# EAGLE design DHT22 Humidity-Temp (EAGLE 8.6.0)
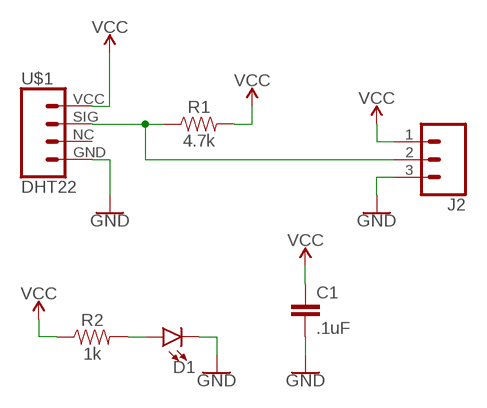
[diagram p0: schematic, sheet 1]

## Parts
C1  .1uF  1.0UF-0805-25V-(+80/-20%)  [0805]
D1  LED-3MM-NO_SILK  [LED_3MM-NS]
J2  CONN_03LONGPADS  [1X03_LONGPADS]
R1  4.7k  0.3OHM-0805-1/8W-1%  [0805]
R2  1k  0.3OHM-0805-1/8W-1%  [0805]
U$1  DHT22  [DHT22]

## Nets
GND: C1.2 D1.K(C) J2.3 U$1.GND
N$4: D1.A R2.2
SIGNAL: J2.2 R1.1 U$1.SIG
VCC: C1.1 J2.1 R1.2 R2.1 U$1.VCC
Unconnected: U$1.NC

## Library data of the parts
C1 = SparkFun-Capacitors:1.0UF: 1µF ceramic capacitors A capacitor is a passive two-terminal electrical component used to store electrical energy temporarily in an electric field.; PROD_ID: CAP-11625; VALUE: 1.0uF
D1 = SparkFun-LED:LED: LED (Generic) Standard schematic elements and footprints for 5mm, 3mm, 1206, and 0603 sized LEDs. Generic LEDs with no color specified.
J2 = SparkFun-Connectors:CONN_03: Multi connection point. Often used as Generic Header-pin footprint for 0.1 inch spaced/style header connections On any of the 0.1 inch spaced packages, you can populate with these: Break Away Headers - Straight <https://www.sparkfun.com/products/116> (PRT-00116) Break Away Male Headers - Right Angle <https://www.sparkfun.com/products/553> (PRT-00553) Female Headers <https://www.sparkfun.com/products/115> (PRT-00115) Break Away Headers - Machine Pin <https://www.sparkfun.com/products/117> (PRT-00117) Break Away Female Headers - Swiss Machine Pin <https://www.sparkfun.com/products/743> (PRT-00743) Stackable Header - 3 Pin (Female, 0.1") <https://www.sparkfun.com/products/13875> (PRT-13875) For SCREWTERMINALS and SPRING TERMINALS visit here: Screw Terimnals on SparkFun.com <https://www.sparkfun.com/search/results?term=Screw+Terminals> (5mm/3.5mm/2.54mm spacing) This device is also useful as a general connection point to wire up your design to another part of your project. Our various solder wires solder well into these plated through hole pads. Hook-Up Wire - Assortment (Stranded, 22 AWG) <https://www.sparkfun.com/products/11375> (PRT-11375) Hook-Up Wire - Assortment (Solid Core, 22 AWG) <https://www.sparkfun.com/products/11367> (PRT-11367) View the entire wire category on our website here <https://www.sparkfun.com/categories/141> Special notes: Molex polarized connector foot print use with SKU : PRT-08232 with associated crimp pins and housings.
R1 R2 = SparkFun-Resistors:0.3OHM: 0.3Ω resistor A resistor is a passive two-terminal electrical component that implements electrical resistance as a circuit element. Resistors act to reduce current flow, and, at the same time, act to lower voltage levels within circuits. - Wikipedia; PROD_ID: RES-11622; VALUE: 0.3
U$1 = SparkFun-Connectors:DHT22: DHT22 Humidity/Temperature Sensor - Generic Footprint

## Board
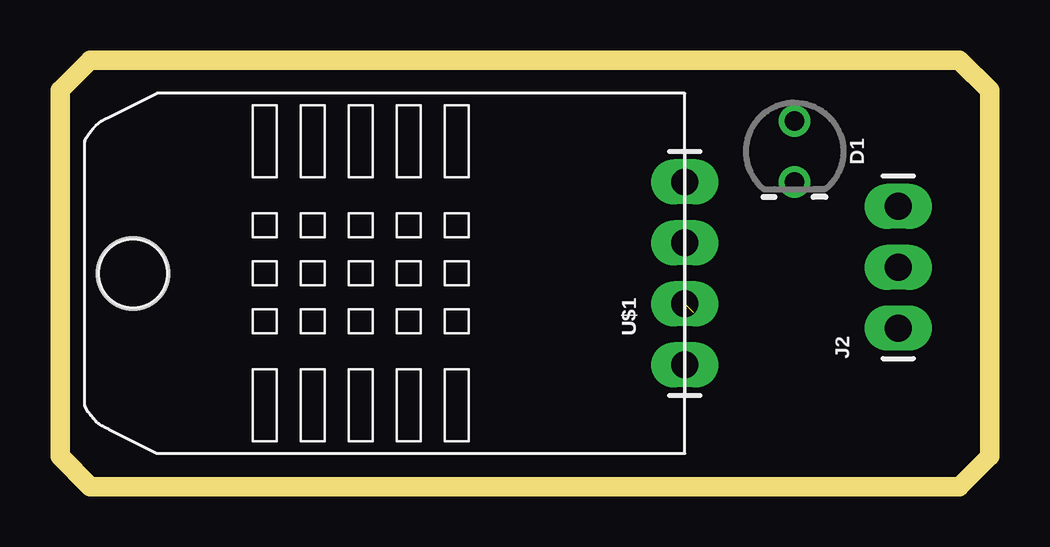
[diagram p1: board, top side]
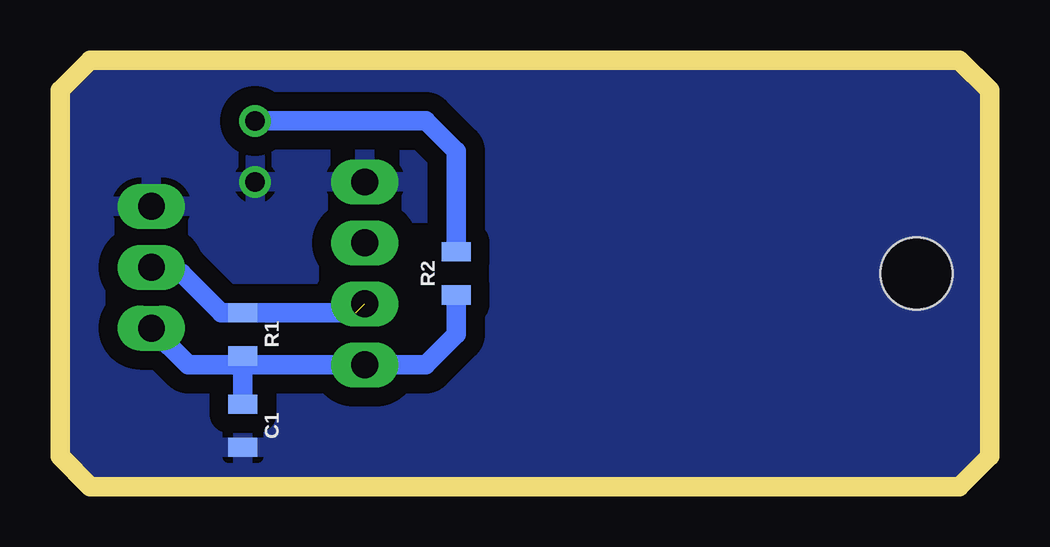
[diagram p2: board, bottom side, seen from below]

Size 38.74 x 17.78 mm. Coordinates in mm from the lower left corner, seen from the top.
Outline: 38.74,16.51 38.74,1.27 37.47,0 1.27,0 0,1.27 0,16.51 1.27,17.78 37.47,17.78 38.74,16.51
Copper layers (1*16): Top 0.035mm / dielectric 1.5mm / Bottom 0.035mm
Design rules "OthermillDRC_1_32_v2": minimum track width 8mil, minimum drill 0.8mm, track to track 0.794003125mm, track to pad 0.794003125mm, pad to pad 0.794003125mm, via to via 0.794003125mm, smd to smd 0mil, copper to edge 0mil, drill to drill 1mil, minimum pad ring 10mil, minimum via ring 10mil, stop-mask expansion 1mil, vias tented up to drill 30mil, thermal gap 10mil
Holes 3 mm at 3.05,8.89

### Footprints (pad centres in the part's own frame; a part is rotated, then mirrored left to right if it is on the bottom)
0805 = smd 0.8 x 1.2: 1 -0.9,0; 2 0.9,0
LED_3MM-NS = drill 0.813: A -1.27,0; K 1.27,0
1X03_LONGPADS = drill 1.118 pad 1.88 long: 1 0,0; 2 2.54,0; 3 5.08,0
DHT22 = drill 1.118 pad 1.88 long: GND 3.81,0; NC 1.27,0; SIG -1.27,0; VCC -3.81,0

### Placement (x,y rotation side)
C1  31.12,2.54 270 bottom
D1  30.61,13.97 270 top
J2  34.93,6.6 90 top
R1  31.12,6.35 270 bottom
R2  22.23,8.89 90 bottom
U$1  26.04,8.89 90 top

### Tracks (layer width: path | path; a pad name or v marks a point on that pad's centre or on a via)
GND
  pour Bottom: 0,16.51 0,1.27 1.27,0 37.47,0 38.74,1.27 38.74,16.51 37.47,17.78 1.27,17.78
N$4
  Bottom 0.813: D1.A 23.5,15.24 22.23,13.97 R2.2
SIGNAL  (1 unrouted)
  Bottom 0.813: 26.41,7.25 R1.1 32.02,7.25 33.66,8.89 34.67,8.89 J2.2
VCC
  Bottom 0.813: J2.1 33.4,5.08 31.12,5.08 | 31.12,5.08 R1.2 | 31.12,5.08 U$1.VCC 23.5,5.08 22.23,6.35 R2.1 | C1.1 31.12,5.08